# Altium project ESP_Encoder_brd.PrjPcb
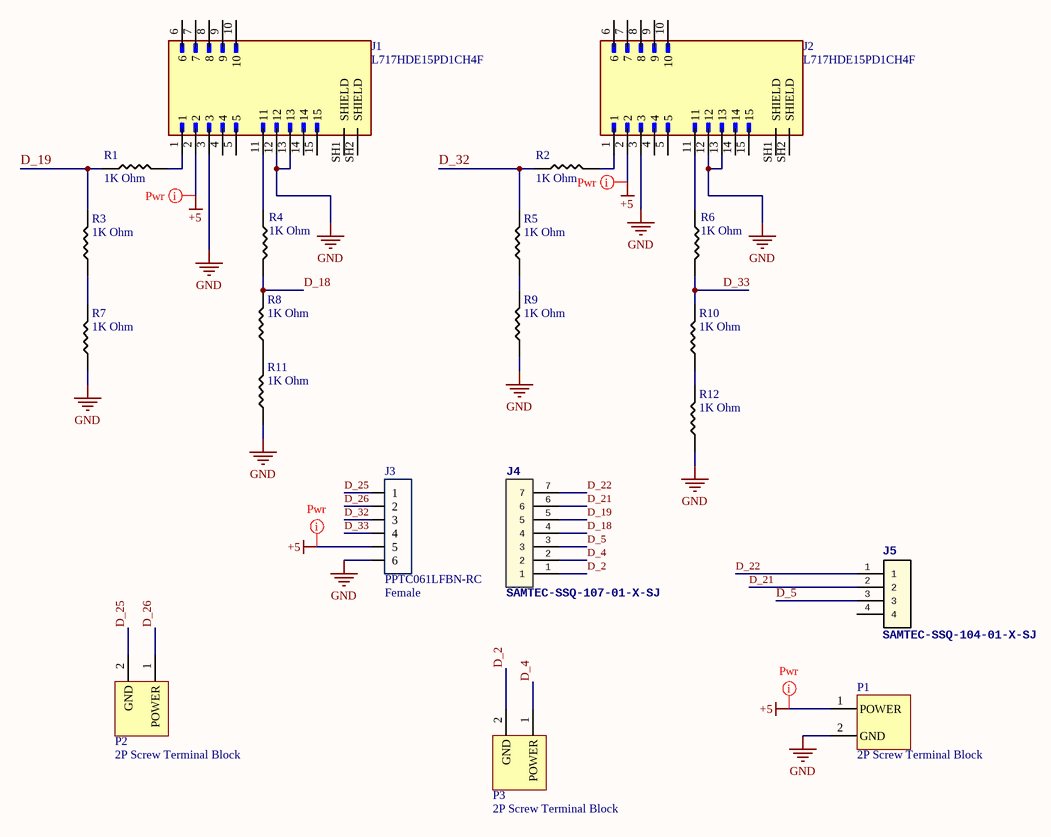
[diagram p0: ESP_Encoder Layout.SchDoc]
1 sheet, 20 parts. Net scope: global (net labels, ports and power ports of the same name join across sheets).
Board file: PCB2.PcbDoc

## Sheet ESP_Encoder Layout.SchDoc
size A3; SheetNumber: 1; SheetTotal: 1

### Parts
J1  L717HDE15PD1CH4F  [AMPHENOL_L717HDE15PD1CH4F]
J2  L717HDE15PD1CH4F  [AMPHENOL_L717HDE15PD1CH4F]
J3  PPTC061LFBN-RC  value Female  [6_PIN_100MIL -Female]
J4  SAMTEC-SSQ-107-01-X-SJ  [JF-7_SSQ-107-01-X-S]
J5  SAMTEC-SSQ-104-01-X-SJ  [JF-4_SSQ-104-01-X-S]
P1  2P Screw Terminal Block  [P_Terminal block 3.5mm-pitch]
P2  2P Screw Terminal Block  [P_Terminal block 3.5mm-pitch]
P3  2P Screw Terminal Block  [P_Terminal block 3.5mm-pitch]
R1  value 1K Ohm  [1206_Passive_Resitor]  (hidden comment: 1k)
R2  value 1K Ohm  [1206_Passive_Resitor]  (hidden comment: 1k)
R3  value 1K Ohm  [1206_Passive_Resitor]  (hidden comment: 1k)
R4  value 1K Ohm  [1206_Passive_Resitor]  (hidden comment: 1k)
R5  value 1K Ohm  [1206_Passive_Resitor]  (hidden comment: 1k)
R6  value 1K Ohm  [1206_Passive_Resitor]  (hidden comment: 1k)
R7  value 1K Ohm  [1206_Passive_Resitor]  (hidden comment: 1k)
R8  value 1K Ohm  [1206_Passive_Resitor]  (hidden comment: 1k)
R9  value 1K Ohm  [1206_Passive_Resitor]  (hidden comment: 1k)
R10  value 1K Ohm  [1206_Passive_Resitor]  (hidden comment: 1k)
R11  value 1K Ohm  [1206_Passive_Resitor]  (hidden comment: 1k)
R12  value 1K Ohm  [1206_Passive_Resitor]  (hidden comment: 1k)

### Nets
+5: J1.2 J2.2 J3.5 P1.1(POWER)
GND: J1.3 J1.12 J1.13 J2.3 J2.12 J2.13 J3.6 P1.2(GND) R7.1 R9.1 R11.1 R12.1
D_2: J4.1 P3.2(GND)
D_4: J4.2 P3.1(POWER)
D_5: J4.3 J5.3
D_18: J4.4 R4.2 R8.2
D_19: J4.5 R1.1 R3.2
D_21: J4.6 J5.2
D_22: J4.7 J5.1
D_25: J3.1 P2.2(GND)
D_26: J3.2 P2.1(POWER)
D_32: J3.3 R2.1 R5.2
D_33: J3.4 R6.2 R10.2
NetJ1_1: J1.1 R1.2
NetJ1_11: J1.11 R4.1
NetJ2_1: J2.1 R2.2
NetJ2_11: J2.11 R6.1
NetR3_1: R3.1 R7.2
NetR5_1: R5.1 R9.2
NetR8_1: R8.1 R11.2
NetR10_1: R10.1 R12.2

Not connected (* = marked no-connect by the designer): J1 4 5 6 7 8 9 10 14 15 SH1(SHIELD) SH2(SHIELD); J2 4 5 6 7 8 9 10 14 15 SH1(SHIELD) SH2(SHIELD); J5 4

### Layout directives
rule Width Constraint [Pref Width = 20mil    Min Width = 10mil    Max Width = 100mil]: +5

### Library data of the parts
J1 J2 = L717HDE15PD1CH4F: Dsub, Stamped Signal 3A, High Density, Right Angle PCB Thru Hole, FP=8.89mm (0.35Î¼in), 15 Pin, Flash Gold, 4-40 Front Screwlock, Ground Tab, With Boardlock; MF: Amphenol ICC; SnapEDA_Link: https://www.snapeda.com/parts/L717HDE15PD1CH4F/Amphenol+FCI/view-part/?ref=snap; Package: None; Value: *; MP: L717HDE15PD1CH4F; Check_prices: https://www.snapeda.com/parts/L717HDE15PD1CH4F/Amphenol+FCI/view-part/?ref=eda
J3 = JF_6_PIN_FEMALE: 6 Position Header Connector 0.100" (2.54mm) Through Hole Tin; Digikey Link: https://www.digikey.com/product-detail/en/PPTC061LFBN-RC/S7004-ND/810145/?itemSeq=304982353; MFR Part #: PPTC061LFBN-RC; LCSC Part#: C40877; Type: Extended
J4 = JF_7_PIN_FEMALE: 2.54mm Brass Straight 1x7P 7 1 Straight,P=2.54mm  Female Headers ROHS; MFR PART #: B-2200S07P-A120; MP: SAMTEC-SSQ-107-01-X-SJ; LCSC PART#: C124418
J5 = JF_4_PIN_FEMALE: 2.54mm 3A bronze -40℃~+105℃ Straight 1x4P Top 4 1 Square Holes Straight,P=2.54mm  Female Headers ROHS; MFR PART #: SSQ-104-01-X-SJ; LCSC PART#: C2718488
P1-P3 = P_Terminal block: Green Straight pin 3.5mm  pitch; P=3.5mm  Screw terminal ROHS; MFR Part #: KF350-3.5-2P; Manufacturer: Cixi Kefa Elec; LCSC Part#: C474892; DataSheet: https://datasheet.lcsc.com/lcsc/2001160007_Cixi-Kefa-Elec-KF350-3-5-2P_C474892.pdf
R1-R12 = R_1K_1206: CHIP RESISTOR - SURFACE MOUNT 1KOHMS ±1% 1/4W 1206 ROHS; MFR Part #: RNCP1206FTD1K00CT; Digikey Link: https://www.digikey.com/product-detail/en/RNCP1206FTD1K00/RNCP1206FTD1K00CT-ND/2240675/?itemSeq=304982373; LCSC Part#: C4410; Type: Basic